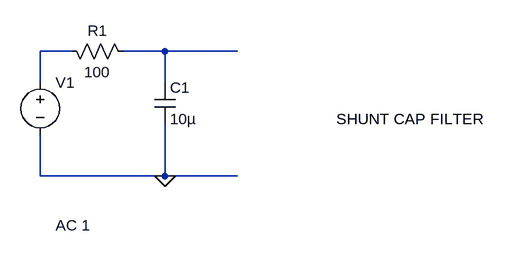
[diagram p0: schematic Shunt_Capa_Filter_2022023.asc]
Shunt_Capa_Filter_2022023.asc, the LTspice schematic file:
Version 4
SHEET 1 880 680
WIRE 48 96 0 96
WIRE 192 96 128 96
WIRE 304 96 192 96
WIRE 0 144 0 96
WIRE 192 144 192 96
WIRE 0 288 0 224
WIRE 192 288 192 208
WIRE 192 288 0 288
WIRE 304 288 192 288
FLAG 192 288 0
SYMBOL cap 176 144 R0
SYMATTR InstName C1
SYMATTR Value 10µ
SYMBOL res 32 80 M90
WINDOW 0 0 56 VBottom 2
WINDOW 3 32 56 VTop 2
SYMATTR InstName R1
SYMATTR Value 100
SYMBOL voltage 0 128 R0
WINDOW 3 24 208 Left 2
WINDOW 123 24 236 Left 2
WINDOW 39 0 0 Left 0
SYMATTR Value ""
SYMATTR Value2 AC 1
SYMATTR InstName V1
TEXT 456 200 Left 2 !SHUNT CAP FILTER

The netlist it stands for:
* Shunt_Capa_Filter_2022023.asc
C1 N002 0 10µ
R1 N001 N002 100
V1 N001 0 AC 1
SHUNT CAP FILTER
.backanno
.end